# EAGLE design Sensor8A (EAGLE 9.2.2)
Assembly variants: J1
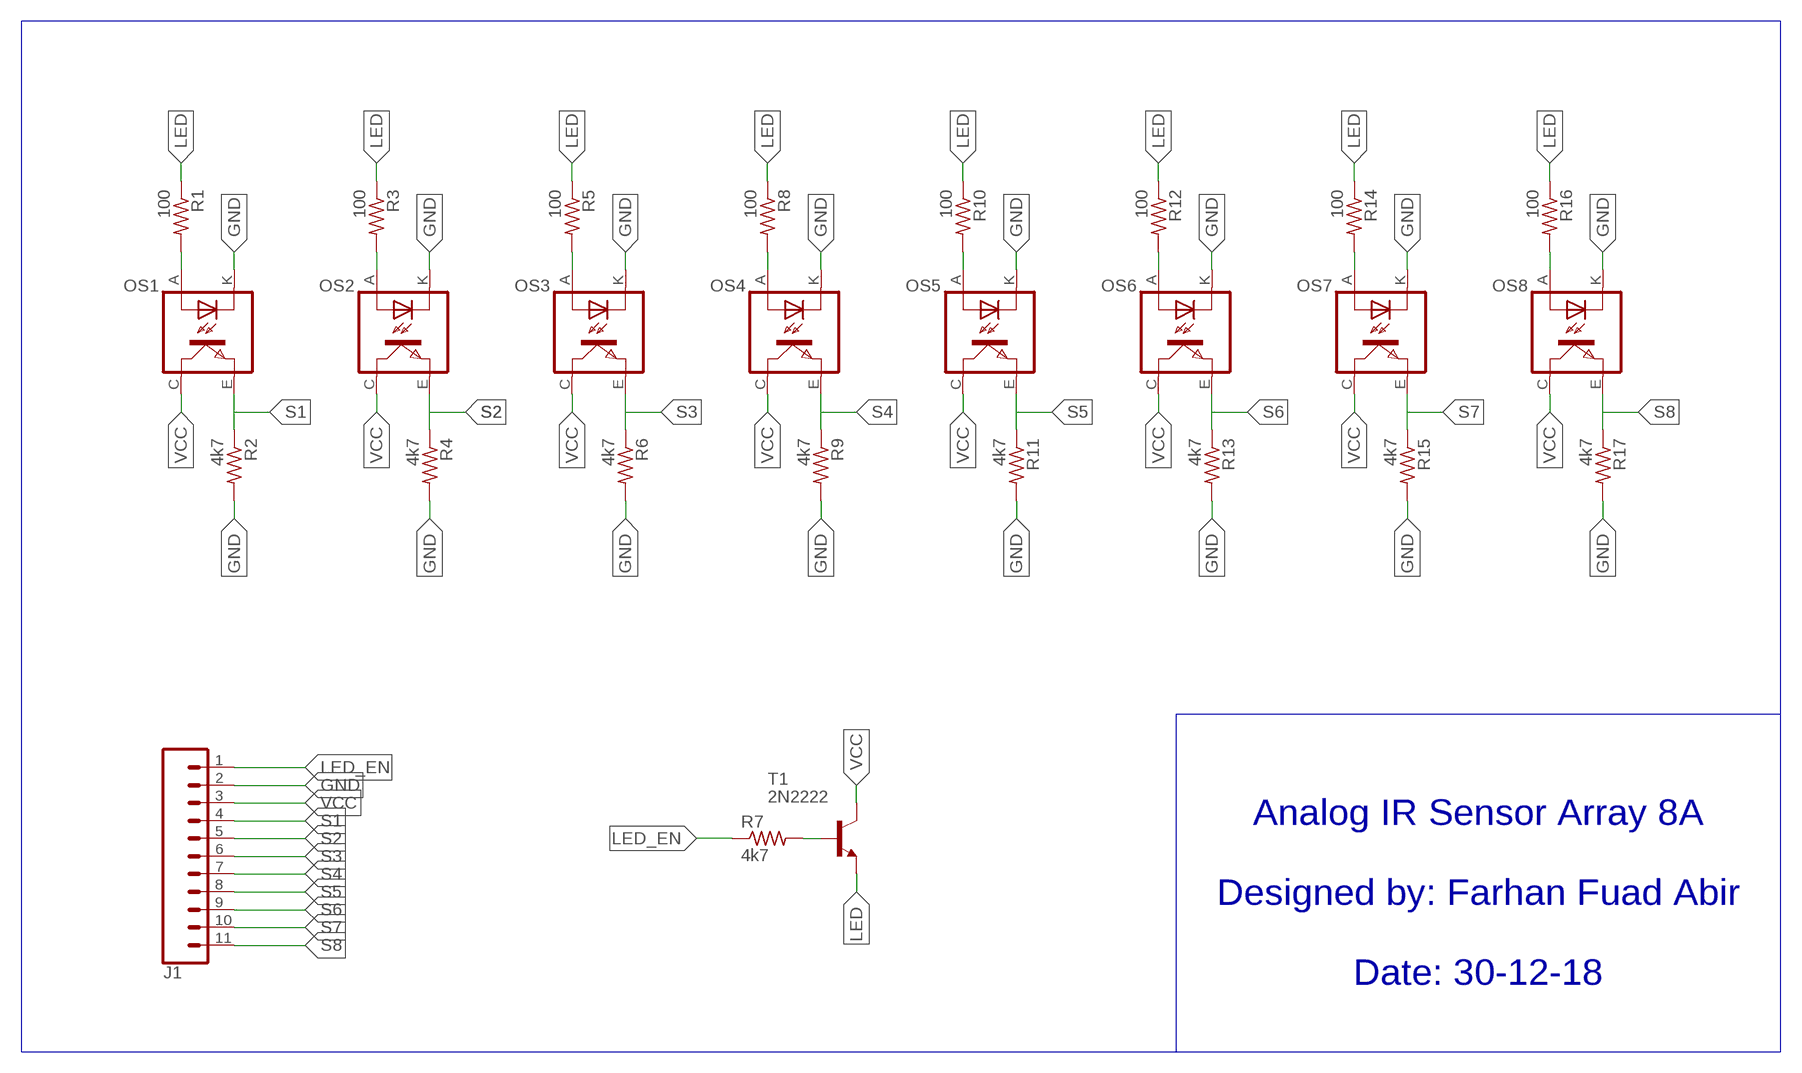
[diagram p0: schematic, sheet 1]

## Parts
J1  CONN_11LONGPADS  [1X11_LONGPADS]
OS1  TCRT5000  [TCRT5000]
OS2  TCRT5000  [TCRT5000]
OS3  TCRT5000  [TCRT5000]
OS4  TCRT5000  [TCRT5000]
OS5  TCRT5000  [TCRT5000]
OS6  TCRT5000  [TCRT5000]
OS7  TCRT5000  [TCRT5000]
OS8  TCRT5000  [TCRT5000]
R1  100  R-US_0204/7  [0204/7]
R2  4k7  R-US_0204/7  [0204/7]
R3  100  R-US_0204/7  [0204/7]
R4  4k7  R-US_0204/7  [0204/7]
R5  100  R-US_0204/7  [0204/7]
R6  4k7  R-US_0204/7  [0204/7]
R7  4k7  R-US_0204/7  [0204/7]
R8  100  R-US_0204/7  [0204/7]  (not fitted in variant J1)
R9  4k7  R-US_0204/7  [0204/7]
R10  100  R-US_0204/7  [0204/7]
R11  4k7  R-US_0204/7  [0204/7]
R12  100  R-US_0204/7  [0204/7]
R13  4k7  R-US_0204/7  [0204/7]
R14  100  R-US_0204/7  [0204/7]
R15  4k7  R-US_0204/7  [0204/7]
R16  100  R-US_0204/7  [0204/7]
R17  4k7  R-US_0204/7  [0204/7]
T1  2N2222  [TO92-EBC-OVAL]

## Nets
GND: J1.2 OS1.K(CATHODE) OS2.K(CATHODE) OS3.K(CATHODE) OS4.K(CATHODE) OS5.K(CATHODE) OS6.K(CATHODE) OS7.K(CATHODE) OS8.K(CATHODE) R2.2 R4.2 R6.2 R9.2 R11.2 R13.2 R15.2 R17.2
LED: R1.1 R3.1 R5.1 R8.1 R10.1 R12.1 R14.1 R16.1 T1.E
LED_EN: J1.1 R7.1
N$1: OS1.A(ANODE) R1.2
N$2: OS2.A(ANODE) R3.2
N$3: OS3.A(ANODE) R5.2
N$4: OS4.A(ANODE) R8.2
N$5: OS5.A(ANODE) R10.2
N$6: OS6.A(ANODE) R12.2
N$7: OS7.A(ANODE) R14.2
N$8: OS8.A(ANODE) R16.2
N$9: R7.2 T1.B
S1: J1.4 OS1.E(EMITTER) R2.1
S2: J1.5 OS2.E(EMITTER) R4.1
S3: J1.6 OS3.E(EMITTER) R6.1
S4: J1.7 OS4.E(EMITTER) R9.1
S5: J1.8 OS5.E(EMITTER) R11.1
S6: J1.9 OS6.E(EMITTER) R13.1
S7: J1.10 OS7.E(EMITTER) R15.1
S8: J1.11 OS8.E(EMITTER) R17.1
VCC: J1.3 OS1.C(COLLECTOR) OS2.C(COLLECTOR) OS3.C(COLLECTOR) OS4.C(COLLECTOR) OS5.C(COLLECTOR) OS6.C(COLLECTOR) OS7.C(COLLECTOR) OS8.C(COLLECTOR) T1.C

## Buses
B$1

## Notes on the sheet
- Analog IR Sensor Array 8A
  
  Designed by: Farhan Fuad Abir
  
  Date: 30-12-18

## Library data of the parts
J1 = SparkFun-Connectors:CONN_11: Multi connection point. Often used as Generic Header-pin footprint for 0.1 inch spaced/style header connections On any of the 0.1 inch spaced packages, you can populate with these: Break Away Headers - Straight <https://www.sparkfun.com/products/116> (PRT-00116) Break Away Male Headers - Right Angle <https://www.sparkfun.com/products/553> (PRT-00553) Female Headers <https://www.sparkfun.com/products/115> (PRT-00115) Break Away Headers - Machine Pin <https://www.sparkfun.com/products/117> (PRT-00117) Break Away Female Headers - Swiss Machine Pin <https://www.sparkfun.com/products/743> (PRT-00743) For SCREWTERMINALS and SPRING TERMINALS visit here: Screw Terimnals on SparkFun.com <https://www.sparkfun.com/search/results?term=Screw+Terminals> (5mm/3.5mm/2.54mm spacing) This device is also useful as a general connection point to wire up your design to another part of your project. Our various solder wires solder well into these plated through hole pads. Hook-Up Wire - Assortment (Stranded, 22 AWG) <https://www.sparkfun.com/products/11375> (PRT-11375) Hook-Up Wire - Assortment (Solid Core, 22 AWG) <https://www.sparkfun.com/products/11367> (PRT-11367) View the entire wire category on our website here <https://www.sparkfun.com/categories/141>
OS1-OS8 = tcrt5000_edited:TCRT5000
R1-R17 = resistor_edited:R-US_: RESISTOR, American symbol; SPICEPREFIX: R
T1 = adafruit:2N2222: NPN TRANSISTOR Big oval pads

## Board
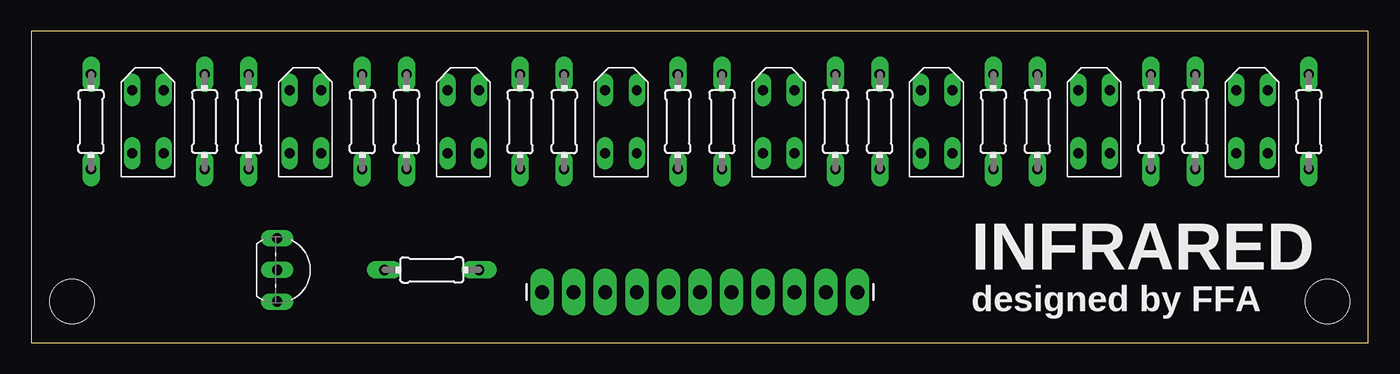
[diagram p1: board, top side]
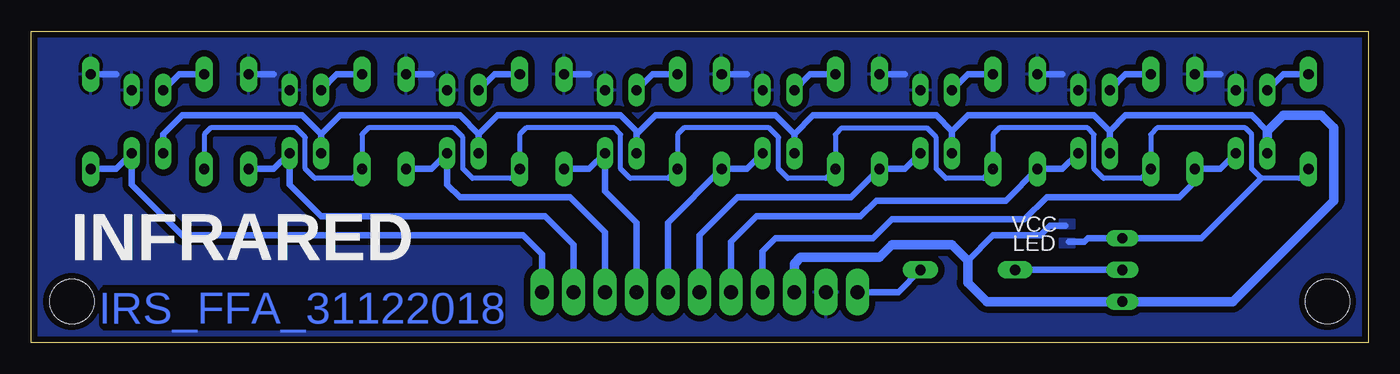
[diagram p2: board, bottom side, seen from below]

Size 107.68 x 25.07 mm. Coordinates in mm from the lower left corner, seen from the top.
Outline: 0,0 107.68,0 107.68,25.07 0,25.07 0,0
Copper layers (1*16): Top 0.035mm / dielectric 1.5mm / Bottom 0.035mm
Design rules "default *": minimum track width 6mil, minimum drill 0.35mm, track to track 6mil, track to pad 6mil, pad to pad 6mil, via to via 6mil, smd to smd 6mil, copper to edge 10mil, drill to drill 6mil, minimum pad ring 10mil, minimum via ring 8mil, stop-mask expansion 4mil, vias tented up to drill 0mil, thermal gap 10mil
Holes 3.56 mm at 3.3,3.3 104.39,3.3

### Footprints (pad centres in the part's own frame; a part is rotated, then mirrored left to right if it is on the bottom)
1X11_LONGPADS = drill 1.118 pad 1.88 long: 1 0,0; 2 2.54,0; 3 5.08,0; 4 7.62,0; 5 10.16,0; 6 12.7,0; 7 15.24,0; 8 17.78,0; 9 20.32,0; 10 22.86,0; 11 25.4,0
TCRT5000 = drill 0.8 long: A -2.54,-1.27; C 2.54,-1.27; E 2.54,1.27; K -2.54,1.27
0204/7 = drill 0.813 pad 1.422 long: 1 -3.81,0; 2 3.81,0
TO92-EBC-OVAL = drill 0.813 long: B 0,-1.27; C 2.54,-1.27; E -2.54,-1.27

### Placement (x,y rotation side)
J1  41.15,4.06 0 top
OS1  9.4,17.78 270 top
OS2  22.1,17.78 270 top
OS3  34.8,17.78 270 top
OS4  47.5,17.78 270 top
OS5  60.2,17.78 270 top
OS6  72.9,17.78 270 top
OS7  85.6,17.78 270 top
OS8  98.3,17.78 270 top
R1  4.83,17.78 90 top
R2  13.97,17.78 90 top
R3  17.53,17.78 90 top
R4  26.67,17.78 90 top
R5  30.23,17.78 90 top
R6  39.37,17.78 90 top
R7  32.26,5.84 180 top
R8  42.93,17.78 90 top
R9  52.07,17.78 90 top
R10  55.63,17.78 90 top
R11  64.77,17.78 90 top
R12  68.33,17.78 90 top
R13  77.47,17.78 90 top
R14  81.03,17.78 90 top
R15  90.17,17.78 90 top
R16  93.73,17.78 90 top
R17  102.87,17.78 90 top
T1  21.08,5.84 270 top

### Tracks (layer width: path | path; a pad name or v marks a point on that pad's centre or on a via)
GND
  Bottom 0.508: 11.94,21.59 R2.2 | 24.64,21.59 R4.2 | 37.34,21.59 R6.2 | 50.04,21.59 R9.2 | 100.84,21.59 R17.2 | 88.14,21.59 R15.2 | 75.44,21.59 R13.2 | 62.74,21.59 R11.2
  pour Bottom (isolate 0.508): -0.25,25.15 -0.25,-0.76 109.47,-0.76 109.47,25.4
  cutout Bottom: 70.1,4.57 70.1,1.02 101.85,1.02 101.85,4.57
LED  (7 unrouted)
  Bottom 0.406: R1.1 5.59,13.21 8.64,13.21 9.4,13.97 9.4,16.76 9.91,17.27 17.02,17.27 17.53,16.76 R3.1 18.29,13.21 21.34,13.21 22.1,13.97 22.1,16.76 22.61,17.27 29.72,17.27 30.23,16.76 R5.1 30.99,13.21 34.04,13.21 34.8,13.97 34.8,16.51 35.56,17.27 42.42,17.27 42.93,16.76 R8.1 43.69,13.21 46.74,13.21 47.5,13.97 47.5,16.51 48.26,17.27 55.12,17.27 55.63,16.76 R10.1 56.39,13.21 59.44,13.21 60.2,13.97 60.2,16.76 60.71,17.27 67.82,17.27 68.33,16.76 R12.1 69.09,13.21 72.14,13.21 72.9,13.97 72.9,16.51 73.66,17.27 80.52,17.27 81.03,16.76 R14.1 81.79,13.21 84.84,13.21 85.6,13.97 85.6,16.51 86.36,17.27 93.22,17.27 93.73,16.76 R16.1
  Bottom 0.508: 8.64,13.21 13.46,8.38 T1.E 22.61,8.38 22.86,8.13 24.13,8.13
  pour Bottom: 23.62,8.38 24.89,8.38 24.89,7.62 23.62,7.62
LED_EN
  Bottom 0.508: J1.1 37.85,4.06 R7.1
N$1
  Bottom 0.508: R1.2 6.86,21.59 OS1.A
N$2
  Bottom 0.508: R3.2 19.56,21.59 OS2.A
N$3
  Bottom 0.508: R5.2 32.26,21.59 OS3.A
N$4
  Bottom 0.508: R8.2 44.96,21.59 OS4.A
N$5
  Bottom 0.508: R10.2 57.66,21.59 OS5.A
N$6
  Bottom 0.508: R12.2 70.36,21.59 OS6.A
N$7
  Bottom 0.508: R14.2 83.06,21.59 OS7.A
N$8
  Bottom 0.508: R16.2 95.76,21.59 OS8.A
N$9
  Bottom 0.508: R7.2 T1.B
S1
  Bottom 0.508: OS1.E 11.94,13.97 R2.1 13.97,12.95 15.24,11.68 24.64,11.68 25.91,11.68 27.69,9.91 38.35,9.91 39.88,8.38 47.75,8.38 48.77,7.37 J1.4
S2
  Bottom 0.508: OS2.E 24.64,13.97 R4.1 29.21,11.43 39.62,11.43 40.89,10.16 49.28,10.16 51.31,8.13 J1.5
S3
  Bottom 0.508: OS3.E 37.34,13.97 R6.1 41.66,11.68 50.8,11.68 53.85,8.64 J1.6
S4  (1 unrouted)
  Bottom 0.508: 48.77,14.73 OS4.E 50.04,13.97 R9.1 56.39,9.65 J1.7
S5  (1 unrouted)
  Bottom 0.508: R11.1 62.74,13.97 OS5.E 61.47,12.19 58.93,9.65 J1.8
S6
  Bottom 0.508: R13.1 75.44,13.97 OS6.E 74.17,12.7 73.15,11.68 64.26,11.68 61.47,8.89 J1.9
S7
  Bottom 0.508: R15.1 88.14,13.97 OS7.E 86.87,12.7 84.33,10.16 66.29,10.16 64.01,7.87 J1.10
S8
  Bottom 0.508: R17.1 100.84,13.97 OS8.E 99.57,12.7 95.5,8.64 68.07,8.64 66.55,7.11 J1.11
VCC
  Bottom 0.508: 8.13,17.02 9.4,18.29 19.56,18.29 20.83,17.02 | 20.83,17.02 OS2.C | 20.83,17.02 22.1,18.29 32.26,18.29 33.53,17.02 | 33.53,17.02 OS3.C | 33.53,17.02 34.8,18.29 44.7,18.29 46.23,16.76 | 46.23,16.76 OS4.C | 46.23,16.76 47.75,18.29 57.4,18.29 58.93,16.76 | 58.93,16.76 OS5.C | 58.93,16.76 58.93,17.02 60.2,18.29 70.1,18.29 71.63,16.76 | 71.63,16.76 OS6.C | 71.63,16.76 73.15,18.29 82.8,18.29 84.33,16.76 | 84.33,16.76 OS7.C | 84.33,16.76 85.85,18.29 95.5,18.29 97.03,16.76 OS8.C | 32.26,6.6 30.23,8.64 26.42,8.64 25.65,9.4 24.38,9.4 | 24.38,9.4
  Bottom 0.762: J1.3 46.23,6.35 45.72,6.86 39.37,6.86 38.35,7.87 33.53,7.87 32.26,6.6 32.26,4.83 30.73,3.3 T1.C 10.92,3.3 2.79,11.43 2.79,17.27 3.81,18.29 6.86,18.29 8.13,17.02 OS1.C
  pour Bottom: 23.62,9.91 24.89,9.91 24.89,9.14 23.62,9.14

### Text on the board
Bottom: IRS_FFA_31122018
tNames: INFRARED | designed by FFA
bNames: VCC / LED | INFRARED